# Altium project MCORD_Hub_v1.1.PrjPcb (part 1 of 4)
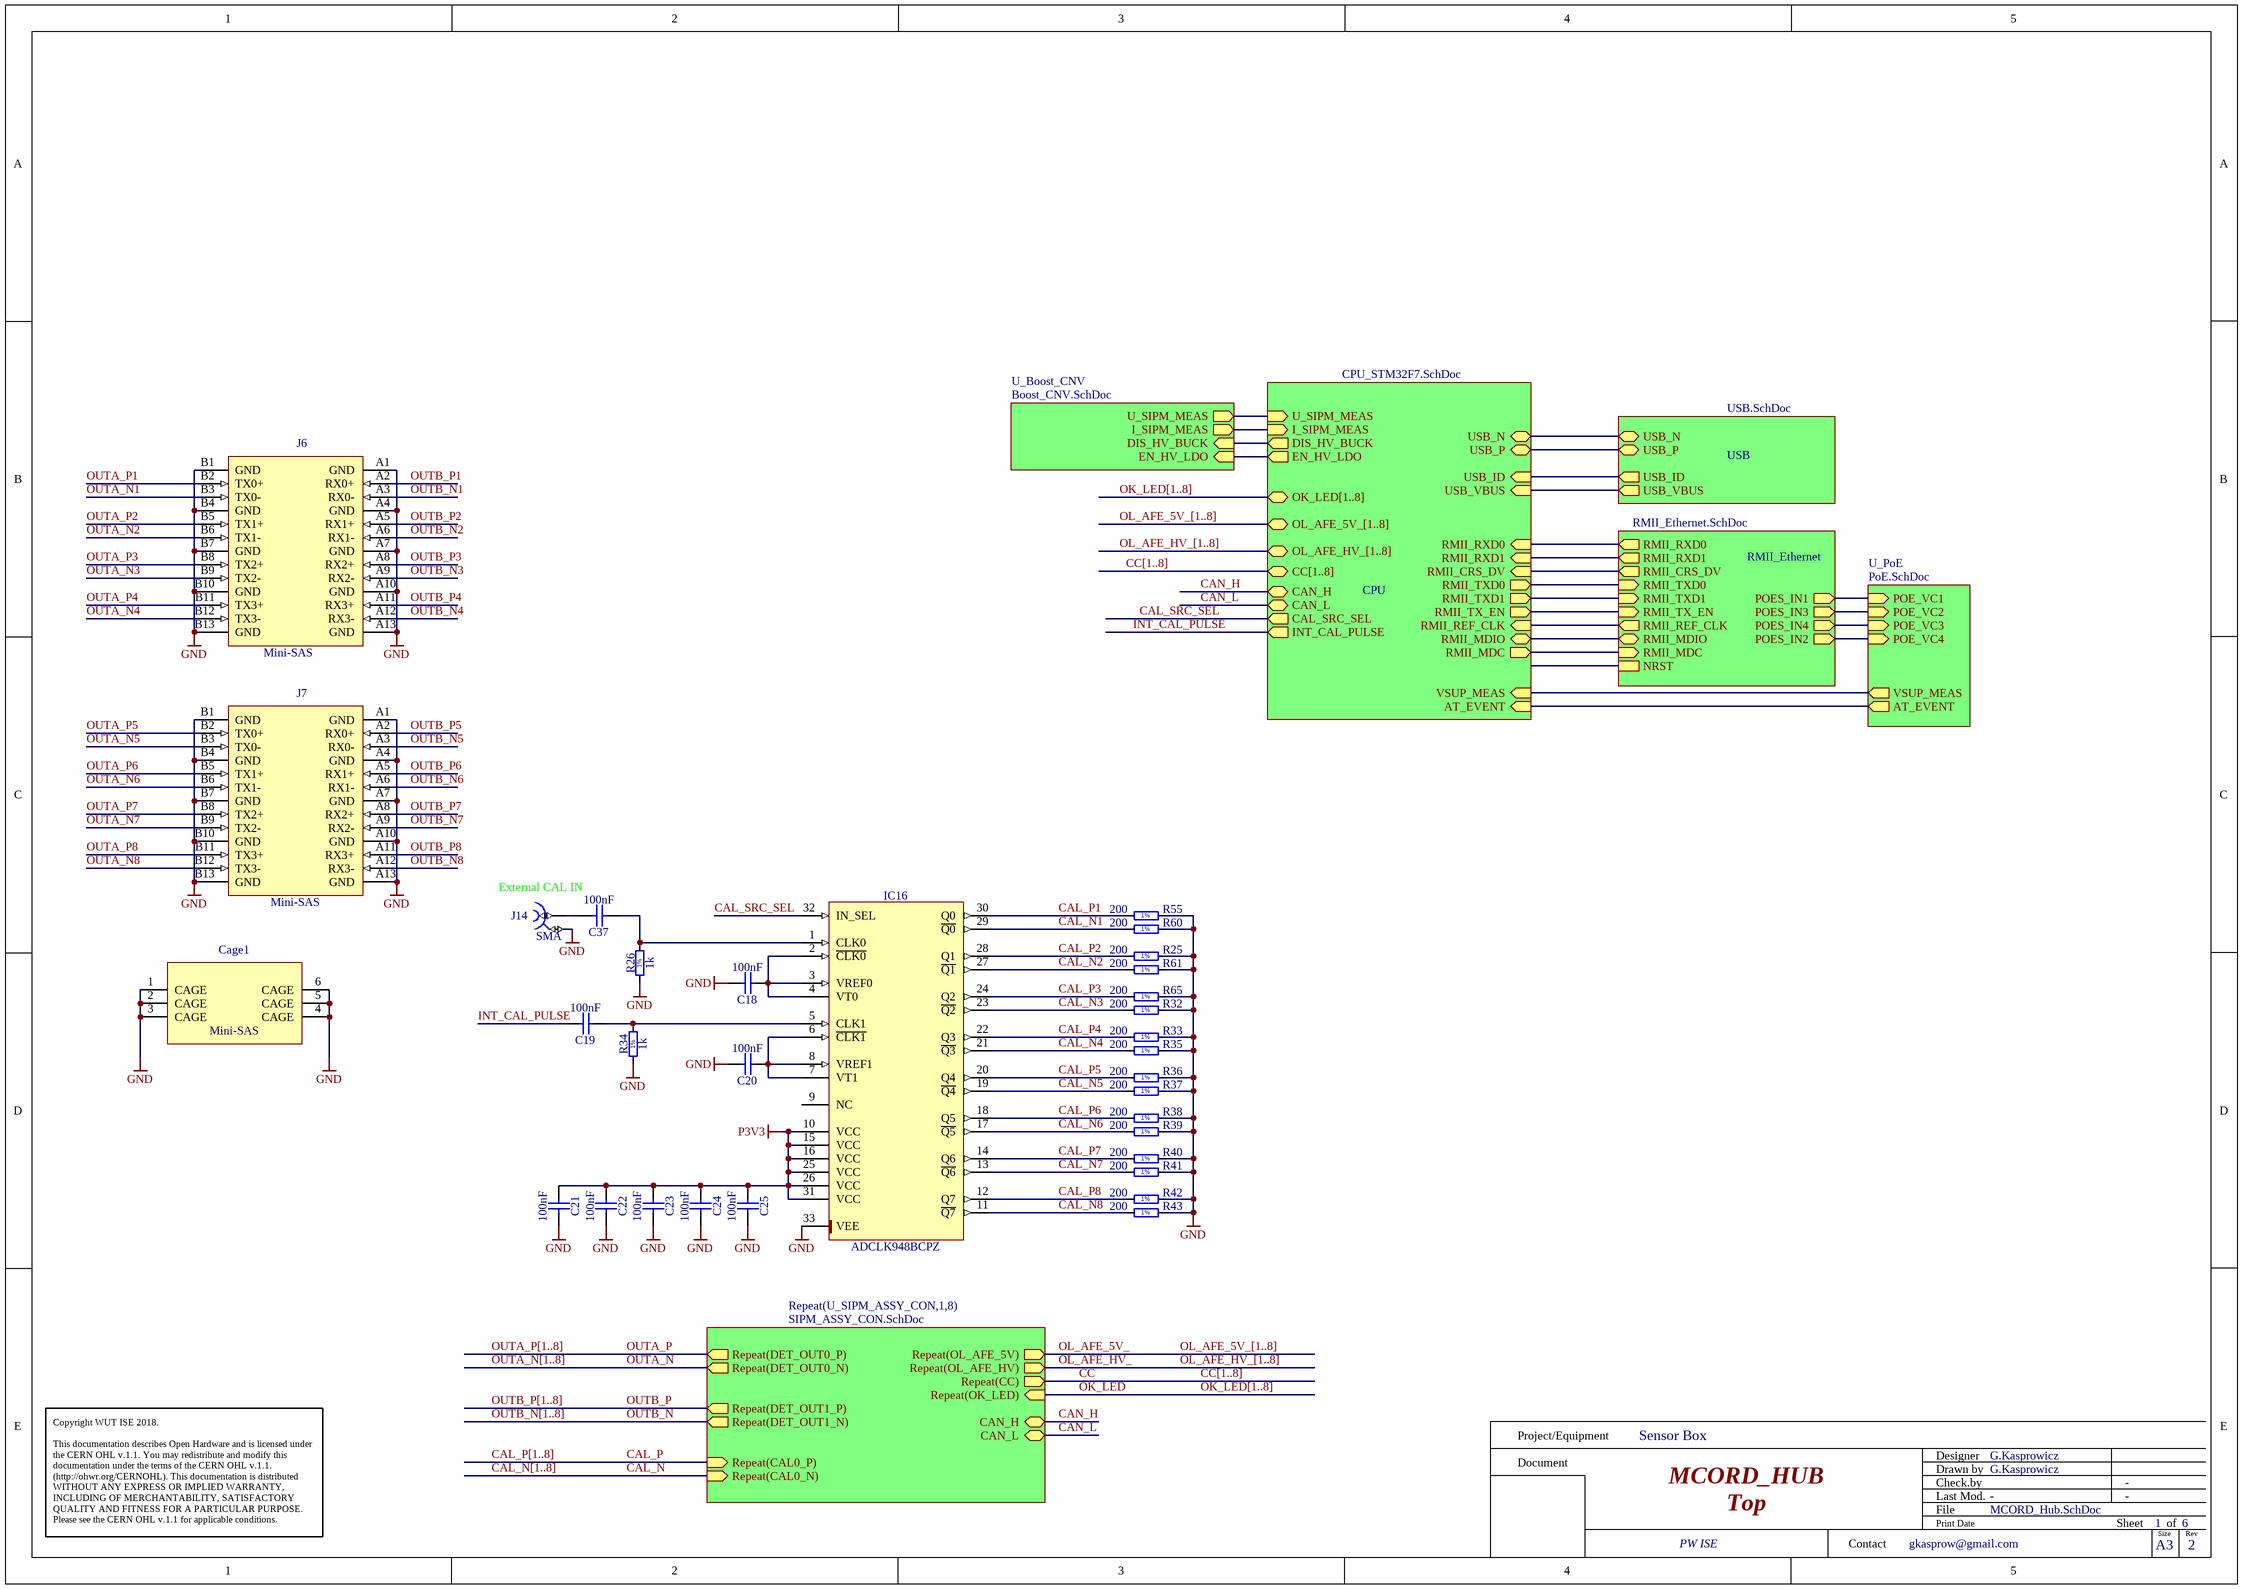
[diagram p0: MCORD_Hub.SchDoc]
7 sheets, 384 parts. Net scope: hierarchical (ports join the sheet entries above them; power ports are global).
Board file: MCORD_Hub.PcbDoc
Sheets:
  MCORD_Hub.SchDoc
    U_SIPM_ASSY_CON1 = SIPM_ASSY_CON.SchDoc
    U_SIPM_ASSY_CON2 = SIPM_ASSY_CON.SchDoc
    U_SIPM_ASSY_CON3 = SIPM_ASSY_CON.SchDoc
    U_SIPM_ASSY_CON4 = SIPM_ASSY_CON.SchDoc
    U_SIPM_ASSY_CON5 = SIPM_ASSY_CON.SchDoc
    U_SIPM_ASSY_CON6 = SIPM_ASSY_CON.SchDoc
    U_SIPM_ASSY_CON7 = SIPM_ASSY_CON.SchDoc
    U_SIPM_ASSY_CON8 = SIPM_ASSY_CON.SchDoc
    U_Boost_CNV = Boost_CNV.SchDoc
    RMII_Ethernet = RMII_Ethernet.SchDoc
    USB = USB.SchDoc
    CPU = CPU_STM32F7.SchDoc
    U_PoE = PoE.SchDoc

## Sheet MCORD_Hub.SchDoc: MCORD_HUB
size 420 x 297 mm; Author: G.Kasprowicz; CompanyName: WUT ISE; DrawnBy: G.Kasprowicz; Organization: WUT ISE; Address1: PW ISE; Address2: Nowowiejska 15/19 00-665 Warsaw; Address3: gkasprow@gmail.com; DocumentNumber: 1; Revision: 2; SheetNumber: 1; SheetTotal: 6; ModifiedBy: -; CheckedDate: -; Title2: Top; DivGrp: WUT ISE; Designer: G.Kasprowicz; ModifiedDate: -; ProjectName: Sensor Box

### Parts
C18  100nF  [CAPC1005X55N]
C19  100nF  [CAPC1005X55N]
C20  100nF  [CAPC1005X55N]
C21  100nF  [CAPC1005X55N]
C22  100nF  [CAPC1005X55N]
C23  100nF  [CAPC1005X55N]
C24  100nF  [CAPC1005X55N]
C25  100nF  [CAPC1005X55N]
C37  100nF  [CAPC1005X55N]
Cage1  Mini-SAS  [TYCO_1888321-2]
IC16  ADCLK948BCPZ  [QFN50P500X500X80-33N-S285]
J6  Mini-SAS  [TYCO_1761987-7]
J7  Mini-SAS  [TYCO_1761987-7]
J14  SMA  [RF249BT0050GHDW]
R25  200  [RESC1005X40N]
R26  1k  [RESC1005X40N]
R32  200  [RESC1005X40N]
R33  200  [RESC1005X40N]
R34  1k  [RESC1005X40N]
R35  200  [RESC1005X40N]
R36  200  [RESC1005X40N]
R37  200  [RESC1005X40N]
R38  200  [RESC1005X40N]
R39  200  [RESC1005X40N]
R40  200  [RESC1005X40N]
R41  200  [RESC1005X40N]
R42  200  [RESC1005X40N]
R43  200  [RESC1005X40N]
R55  200  [RESC1005X40N]
R60  200  [RESC1005X40N]
R61  200  [RESC1005X40N]
R65  200  [RESC1005X40N]

### Sub-sheets
CPU = CPU_STM32F7.SchDoc: USB_N (bidir), USB_P (bidir), USB_ID (in), USB_VBUS (in), RMII_TXD0 (out), RMII_TX_EN (out), RMII_RXD0 (in), RMII_REF_CLK (in), RMII_CRS_DV (in), RMII_MDC (out), RMII_MDIO (bidir), RMII_TXD1 (out), RMII_RXD1 (in), U_SIPM_MEAS (in), I_SIPM_MEAS (in), DIS_HV_BUCK (out), EN_HV_LDO (out), CC[1..8] (bidir), CAN_H (bidir), CAN_L (bidir), CAL_SRC_SEL (out), INT_CAL_PULSE (out), OL_AFE_HV_[1..8] (bidir), OL_AFE_5V_[1..8] (bidir), OK_LED[1..8] (bidir), AT_EVENT (in), VSUP_MEAS (in)
Repeat(U_SIPM_ASSY_CON,1,8) = SIPM_ASSY_CON.SchDoc: Repeat(CAL0_N) (in), Repeat(DET_OUT1_N) (out), Repeat(DET_OUT0_N) (out), Repeat(DET_OUT1_P) (out), Repeat(CAL0_P) (in), CAN_H (bidir), Repeat(DET_OUT0_P) (out), CAN_L (bidir), Repeat(CC) (out), Repeat(OL_AFE_HV) (out), Repeat(OL_AFE_5V) (out), Repeat(OK_LED) (in)
RMII_Ethernet = RMII_Ethernet.SchDoc: RMII_TXD0 (in), RMII_TX_EN (in), RMII_RXD0 (out), RMII_REF_CLK (out), RMII_CRS_DV (out), RMII_MDC (in), RMII_MDIO (bidir), NRST, RMII_TXD1 (in), RMII_RXD1 (out), POES_IN1 (out), POES_IN3 (out), POES_IN4 (out), POES_IN2 (out)
U_Boost_CNV = Boost_CNV.SchDoc: U_SIPM_MEAS (out), I_SIPM_MEAS (out), EN_HV_LDO (in), DIS_HV_BUCK (in)
U_PoE = PoE.SchDoc: POE_VC1 (in), POE_VC2 (in), POE_VC3 (in), POE_VC4 (in), AT_EVENT (out), VSUP_MEAS (out)
USB = USB.SchDoc: USB_N (bidir), USB_P (bidir), USB_ID (out), USB_VBUS (out)

### Nets
GND: C18.2 C20.2 C21.2 C22.2 C23.2 C24.2 C25.2 Cage1.1(CAGE) Cage1.2(CAGE) Cage1.3(CAGE) Cage1.4(CAGE) Cage1.5(CAGE) Cage1.6(CAGE) IC16.33(VEE) J6.A1(GND) J6.A4(GND) J6.A7(GND) J6.A10(GND) J6.A13(GND) J6.B1(GND) J6.B4(GND) J6.B7(GND) J6.B10(GND) J6.B13(GND) J7.A1(GND) J7.A4(GND) J7.A7(GND) J7.A10(GND) J7.A13(GND) J7.B1(GND) J7.B4(GND) J7.B7(GND) J7.B10(GND) J7.B13(GND) J14.2 R25.2 R26.1 R32.2 R33.2 R34.1 R35.2 R36.2 R37.2 R38.2 R39.2 R40.2 R41.2 R42.2 R43.2 R55.2 R60.2 R61.2 R65.2
P3V3: C21.1 C22.1 C23.1 C24.1 C25.1 IC16.10(VCC) IC16.15(VCC) IC16.16(VCC) IC16.25(VCC) IC16.26(VCC) IC16.31(VCC)
AT_EVENT: sheet CPU/AT_EVENT, sheet U_PoE/AT_EVENT
CAL_N: sheet Repeat(U_SIPM_ASSY_CON,1,8)/Repeat(CAL0_N)
CAL_N1: IC16.29(~{Q0}) R60.1  [project net CAL0_N]
CAL_N2: IC16.27(~{Q1}) R61.1  [project net CAL0_N]
CAL_N3: IC16.23(~{Q2}) R32.1  [project net CAL0_N]
CAL_N4: IC16.21(~{Q3}) R35.1  [project net CAL0_N]
CAL_N5: IC16.19(~{Q4}) R37.1  [project net CAL0_N]
CAL_N6: IC16.17(~{Q5}) R39.1  [project net CAL0_N]
CAL_N7: IC16.13(~{Q6}) R41.1  [project net CAL0_N]
CAL_N8: IC16.11(~{Q7}) R43.1  [project net CAL0_N]
CAL_P: sheet Repeat(U_SIPM_ASSY_CON,1,8)/Repeat(CAL0_P)
CAL_P1: IC16.30(Q0) R55.1  [project net CAL0_P]
CAL_P2: IC16.28(Q1) R25.1  [project net CAL0_P]
CAL_P3: IC16.24(Q2) R65.1  [project net CAL0_P]
CAL_P4: IC16.22(Q3) R33.1  [project net CAL0_P]
CAL_P5: IC16.20(Q4) R36.1  [project net CAL0_P]
CAL_P6: IC16.18(Q5) R38.1  [project net CAL0_P]
CAL_P7: IC16.14(Q6) R40.1  [project net CAL0_P]
CAL_P8: IC16.12(Q7) R42.1  [project net CAL0_P]
CAL_SRC_SEL: IC16.32(IN_SEL) ; sheet CPU/CAL_SRC_SEL
CAN_H: sheet Repeat(U_SIPM_ASSY_CON,1,8)/CAN_H, sheet CPU/CAN_H
CAN_L: sheet Repeat(U_SIPM_ASSY_CON,1,8)/CAN_L, sheet CPU/CAN_L
CC: sheet Repeat(U_SIPM_ASSY_CON,1,8)/Repeat(CC)
DIS_HV_BUCK: sheet U_Boost_CNV/DIS_HV_BUCK, sheet CPU/DIS_HV_BUCK
EN_HV_LDO: sheet U_Boost_CNV/EN_HV_LDO, sheet CPU/EN_HV_LDO
I_SIPM_MEAS: sheet U_Boost_CNV/I_SIPM_MEAS, sheet CPU/I_SIPM_MEAS
INT_CAL_PULSE: C19.2 ; sheet CPU/INT_CAL_PULSE
OK_LED: sheet Repeat(U_SIPM_ASSY_CON,1,8)/Repeat(OK_LED)
OL_AFE_5V_: sheet Repeat(U_SIPM_ASSY_CON,1,8)/Repeat(OL_AFE_5V)  [also labelled OL_AFE_5V_[1..8]]
OL_AFE_HV_: sheet Repeat(U_SIPM_ASSY_CON,1,8)/Repeat(OL_AFE_HV)  [also labelled OL_AFE_HV_[1..8]]
OUTA_N: sheet Repeat(U_SIPM_ASSY_CON,1,8)/Repeat(DET_OUT0_N)
OUTA_N1: J6.B3(TX0-)  [project net DET_OUT0_N]
OUTA_N2: J6.B6(TX1-)  [project net DET_OUT0_N]
OUTA_N3: J6.B9(TX2-)  [project net DET_OUT0_N]
OUTA_N4: J6.B12(TX3-)  [project net DET_OUT0_N]
OUTA_N5: J7.B3(TX0-)  [project net DET_OUT0_N]
OUTA_N6: J7.B6(TX1-)  [project net DET_OUT0_N]
OUTA_N7: J7.B9(TX2-)  [project net DET_OUT0_N]
OUTA_N8: J7.B12(TX3-)  [project net DET_OUT0_N]
OUTA_P: sheet Repeat(U_SIPM_ASSY_CON,1,8)/Repeat(DET_OUT0_P)
OUTA_P1: J6.B2(TX0+)  [project net DET_OUT0_P]
OUTA_P2: J6.B5(TX1+)  [project net DET_OUT0_P]
OUTA_P3: J6.B8(TX2+)  [project net DET_OUT0_P]
OUTA_P4: J6.B11(TX3+)  [project net DET_OUT0_P]
OUTA_P5: J7.B2(TX0+)  [project net DET_OUT0_P]
OUTA_P6: J7.B5(TX1+)  [project net DET_OUT0_P]
OUTA_P7: J7.B8(TX2+)  [project net DET_OUT0_P]
OUTA_P8: J7.B11(TX3+)  [project net DET_OUT0_P]
OUTB_N: sheet Repeat(U_SIPM_ASSY_CON,1,8)/Repeat(DET_OUT1_N)
OUTB_N1: J6.A3(RX0-)  [project net DET_OUT1_N]
OUTB_N2: J6.A6(RX1-)  [project net DET_OUT1_N]
OUTB_N3: J6.A9(RX2-)  [project net DET_OUT1_N]
OUTB_N4: J6.A12(RX3-)  [project net DET_OUT1_N]
OUTB_N5: J7.A3(RX0-)  [project net DET_OUT1_N]
OUTB_N6: J7.A6(RX1-)  [project net DET_OUT1_N]
OUTB_N7: J7.A9(RX2-)  [project net DET_OUT1_N]
OUTB_N8: J7.A12(RX3-)  [project net DET_OUT1_N]
OUTB_P: sheet Repeat(U_SIPM_ASSY_CON,1,8)/Repeat(DET_OUT1_P)
OUTB_P1: J6.A2(RX0+)  [project net DET_OUT1_P]
OUTB_P2: J6.A5(RX1+)  [project net DET_OUT1_P]
OUTB_P3: J6.A8(RX2+)  [project net DET_OUT1_P]
OUTB_P4: J6.A11(RX3+)  [project net DET_OUT1_P]
OUTB_P5: J7.A2(RX0+)  [project net DET_OUT1_P]
OUTB_P6: J7.A5(RX1+)  [project net DET_OUT1_P]
OUTB_P7: J7.A8(RX2+)  [project net DET_OUT1_P]
OUTB_P8: J7.A11(RX3+)  [project net DET_OUT1_P]
POES_IN1: sheet RMII_Ethernet/POES_IN1, sheet U_PoE/POE_VC1
POES_IN2: sheet RMII_Ethernet/POES_IN2, sheet U_PoE/POE_VC4
POES_IN3: sheet RMII_Ethernet/POES_IN3, sheet U_PoE/POE_VC2
POES_IN4: sheet RMII_Ethernet/POES_IN4, sheet U_PoE/POE_VC3
RMII_CRS_DV: sheet RMII_Ethernet/RMII_CRS_DV, sheet CPU/RMII_CRS_DV
RMII_MDC: sheet RMII_Ethernet/RMII_MDC, sheet CPU/RMII_MDC
RMII_MDIO: sheet RMII_Ethernet/RMII_MDIO, sheet CPU/RMII_MDIO
RMII_REF_CLK: sheet RMII_Ethernet/RMII_REF_CLK, sheet CPU/RMII_REF_CLK
RMII_RXD0: sheet RMII_Ethernet/RMII_RXD0, sheet CPU/RMII_RXD0
RMII_RXD1: sheet RMII_Ethernet/RMII_RXD1, sheet CPU/RMII_RXD1
RMII_TX_EN: sheet RMII_Ethernet/RMII_TX_EN, sheet CPU/RMII_TX_EN
RMII_TXD0: sheet RMII_Ethernet/RMII_TXD0, sheet CPU/RMII_TXD0
RMII_TXD1: sheet RMII_Ethernet/RMII_TXD1, sheet CPU/RMII_TXD1
U_SIPM_MEAS: sheet U_Boost_CNV/U_SIPM_MEAS, sheet CPU/U_SIPM_MEAS
USB_ID: sheet USB/USB_ID, sheet CPU/USB_ID
USB_N: sheet USB/USB_N, sheet CPU/USB_N
USB_P: sheet USB/USB_P, sheet CPU/USB_P
USB_VBUS: sheet USB/USB_VBUS, sheet CPU/USB_VBUS
VSUP_MEAS: sheet CPU/VSUP_MEAS, sheet U_PoE/VSUP_MEAS
NetC18_1: C18.1 IC16.2(~{CLK0}) IC16.3(VREF0) IC16.4(VT0)
NetC19_1: C19.1 IC16.5(CLK1) R34.2
NetC20_1: C20.1 IC16.6(~{CLK1}) IC16.7(VT1) IC16.8(VREF1)
NetC37_1: C37.1 IC16.1(CLK0) R26.2
NetC37_2: C37.2 J14.1

Not connected (* = marked no-connect by the designer): IC16 9(NC)

### Buses and harness runs
bus CAL_N[1..8]
bus CAL_P[1..8]
bus CC[1..8]
bus CC[1..8] = sheet CPU/CC[1..8]
bus OK_LED[1..8]
bus OK_LED[1..8] = sheet CPU/OK_LED[1..8]
bus OL_AFE_5V_[1..8] = sheet CPU/OL_AFE_5V_[1..8]
bus OL_AFE_HV_[1..8] = sheet CPU/OL_AFE_HV_[1..8]
bus OUTA_N[1..8]
bus OUTA_P[1..8]
bus OUTB_N[1..8]
bus OUTB_P[1..8]

### Notes on the sheet
- External CAL IN
- Project/Equipment
- Document
- Designer
- Drawn by
- Check.by
- Copyright WUT ISE 2018.
  This documentation describes Open Hardware and is licensed under the CERN OHL v.1.1. You may redistribute and modify this documentation under the terms of the CERN OHL v.1.1. (http://ohwr.org/CERNOHL). This documentation is distributed WITHOUT ANY EXPRESS OR IMPLIED WARRANTY, INCLUDING OF MERCHANTABILITY, SATISFACTORY QUALITY AND FITNESS FOR A PARTICULAR PURPOSE. Please see the CERN OHL v.1.1 for applicable conditions.
- Contact
- File
- Last Mod.
- Print Date
- Sheet
- Size
- A3
- of
- Rev
- (in symbol R0402_1K_1%_0.0625W_100PPM) 1%
- (in symbol R0402_200R_1%_0.0625W_100PPM) 1%

### Library data of the parts
C18-C25 C37 = CC0402_100NF_16V_10%_X7R: Non-polarised capacitor; Part Description: SMD Multilayer Chip Ceramic Capacitor; Manufacturer: GENERIC; Manufacturer1 Part Number: GRM155R71C104KA88D; Voltage: 16V; TC: X7R; Tolerance: ±10%; Part Number: CC0402_100NF_16V_10%_X7R; Component Kind: Standard; Component Type: Standard; Pin Count: 2; Value: 100nF; Status: Not Recommended; Manufacturer Part Number: CC0402_100NF_16V_10%_X7R; Case: 0402; Mounted: Yes; Socket: No; SMD: Yes; Manufacturer1 Example: MURATA; Manufacturer1 ComponentHeight: 0.55mm; HelpURL: \\cern.ch\dfs\Applications\Altium\Datasheets\CC0402_X7R_MURATA_GRM.pdf; Author: CERN DEM JLC; CreateDate: 05.12.2013; LatestRevisionDate: 03.12.2007; Sense: No
Cage1 = TYCO_1888321-2: Mini-SAS Cage (6Pins); Part Description: Through Hole Dual Port EVERCLEAR Mini-SAS Cage; Manufacturer: TYCO ELECTRONICS; PressFit: No; Part Number: TYCO_1888321-2; Component Kind: Standard; Component Type: Standard; Pin Count: 10; Family: Mini-SAS; Mounted: Yes; Socket: No; SMD: No; Sense: No; Status: None; Manufacturer Part Number: 1888321-2; ComponentHeight: 8.63mm; HelpURL: \\cern.ch\dfs\Applications\Altium\Datasheets\TYCO_1888321-2.pdf; Author: CERN DEM BC; CreateDate: 04.04.2019; LatestRevisionDate: 04.04.2019
IC16 = ADCLK948BCPZ: Two Selectable Inputs, 8 LVPECL Outputs, SiGe Clock Fanout Buffer; Manufacturer: ANALOG DEVICES; PressFit: No; Bonding: No; Part Number: ADCLK948BCPZ; Component Kind: Standard; Component Type: Standard; Device: ADCLK948BCPZ; PackageDescription: QFN, 0.50mm Pitch, Square; 8 Pin X 8 Pin, 5mm X 5mm X 1.00mm H body (w/thermal tab 2.85 X 2.85mm),  IPC Medium Density; Part Description: Two Selectable Inputs, 8 LVPECL Outputs, SiGe Clock Fanout Buffer; Manufacturer Part Number: ADCLK948BCPZ; Pin Count: 33; Case: QFN32; Mounted: Yes; Socket: No; SMD: Yes; Sense: No; ComponentHeight: 0.8mm; Author: CERN DEM MR; HelpURL: \\cern.ch\dfs\Applications\Altium\Datasheets\ADCLK948BCPZ.pdf; CreateDate: 30.11.2016; LatestRevisionDate: 30.11.2016
J6 J7 = TYCO_1761987-7: 26 Position Mini-Sas Connector (Quad Small Form-Factor SFF-8088); Part Description: Surface Mount EVERCLEAR Mini-SAS Right Angle Receptacle (Quad Small Form-Factor SFF-8088); Manufacturer: TYCO ELECTRONICS; PressFit: No; Part Number: TYCO_1761987-7; Component Kind: Standard; Component Type: Standard; Pin Count: 26; Family: Mini-SAS; Mounted: Yes; Socket: No; SMD: Yes; Sense: No; Status: None; Manufacturer Part Number: 1761987-7; ComponentHeight: 5.55mm; HelpURL: \\cern.ch\dfs\Applications\Altium\Datasheets\TYCO_1761987-7.pdf; Author: CERN DEM MR; CreateDate: 24.04.2019; LatestRevisionDate: 24.04.2019
J14 = CON_SMA_RF249BT0050GHDW: 50 Ohm Through Hole SMA Right Angle PCB Jack; Part Number: AdamTech_RF249BT0050GHDW; Manufacturer: AdamTech / Molex; Manufacturer Part Number: RF249BT0050GHDW / 0732512201; PressFit: No; Component Kind: Standard; Component Type: Standard; Pin Count: 5; Family: SMA; Mounted: Yes; Socket: No; SMD: No; Sense: No; Status: None; Part Description: 50 Ohm Through Hole SMA Right Angle PCB Jack; ComponentHeight: 10.44mm; HelpURL: \\cern.ch\dfs\Applications\Altium\Datasheets\AMPHENOL_132203.pdf; Author: GK; CreateDate: 06.10.2016; LatestRevisionDate: 06.10.2016
R25 R32 R33 R35-R43 R55 R60 R61 R65 = R0402_200R_1%_0.0625W_100PPM: Resistor - 1%; Part Description: General Purpose Thick Film Chip Resistor; Manufacturer: GENERIC; Manufacturer1 Part Number: 232270672001L; TC: ±100ppm/°C; PressFit: No; Part Number: R0402_200R_1%_0.0625W_100PPM; Component Kind: Standard; Component Type: Standard; Pin Count: 2; Value: 200; Status: Not Recommended; Power: 0.0625W; Tolerance: ±1%; Manufacturer Part Number: R0402_200R_1%_0.0625W_100PPM; Case: 0402; Mounted: Yes; Sense: No; Socket: No; SMD: Yes; Manufacturer1 Example: YAGEO PHYCOMP; Manufacturer1 ComponentHeight: 0.4mm; HelpURL: \\cern.ch\dfs\Applications\Altium\Datasheets\R0402_Phycomp_RC0402.pdf; Author: CERN DEM JLC; CreateDate: 03.12.2007; LatestRevisionDate: 17.10.2012
R26 R34 = R0402_1K_1%_0.0625W_100PPM: Resistor - 1%; Part Description: General Purpose Thick Film Chip Resistor; Manufacturer: GENERIC; Manufacturer1 Part Number: 232270671002L; TC: ±100ppm/°C; PressFit: No; Part Number: R0402_1K_1%_0.0625W_100PPM; Component Kind: Standard; Component Type: Standard; Pin Count: 2; Value: 1k; Status: Not Recommended; Power: 0.0625W; Tolerance: ±1%; Manufacturer Part Number: R0402_1K_1%_0.0625W_100PPM; Case: 0402; Mounted: Yes; Sense: No; Socket: No; SMD: Yes; Manufacturer1 Example: YAGEO PHYCOMP; Manufacturer1 ComponentHeight: 0.4mm; HelpURL: \\cern.ch\dfs\Applications\Altium\Datasheets\R0402_Phycomp_RC0402.pdf; Author: CERN DEM JLC; CreateDate: 03.12.2007; LatestRevisionDate: 17.10.2012

## Sheet SIPM_ASSY_CON.SchDoc: MCORD_HUB
size 420 x 297 mm; Author: G.Kasprowicz; CompanyName: WUT ISE; DrawnBy: G.Kasprowicz; Organization: WUT ISE; Address1: PW ISE; Address2: Nowowiejska 15/19 00-665 Warsaw; Address3: gkasprow@gmail.com; DocumentNumber: 2; Revision: 2; SheetNumber: 2; SheetTotal: 6; ModifiedBy: -; CheckedDate: -; Title2: SIPM ASSY connector; DivGrp: WUT ISE; Designer: G.Kasprowicz; ModifiedDate: -; ProjectName: Sensor Box
Used 8 times, as channels U_SIPM_ASSY_CON1, U_SIPM_ASSY_CON2, U_SIPM_ASSY_CON3, U_SIPM_ASSY_CON4, U_SIPM_ASSY_CON5, U_SIPM_ASSY_CON6, U_SIPM_ASSY_CON7, U_SIPM_ASSY_CON8. Parts and nets are listed once, with the designators drawn on the sheet.
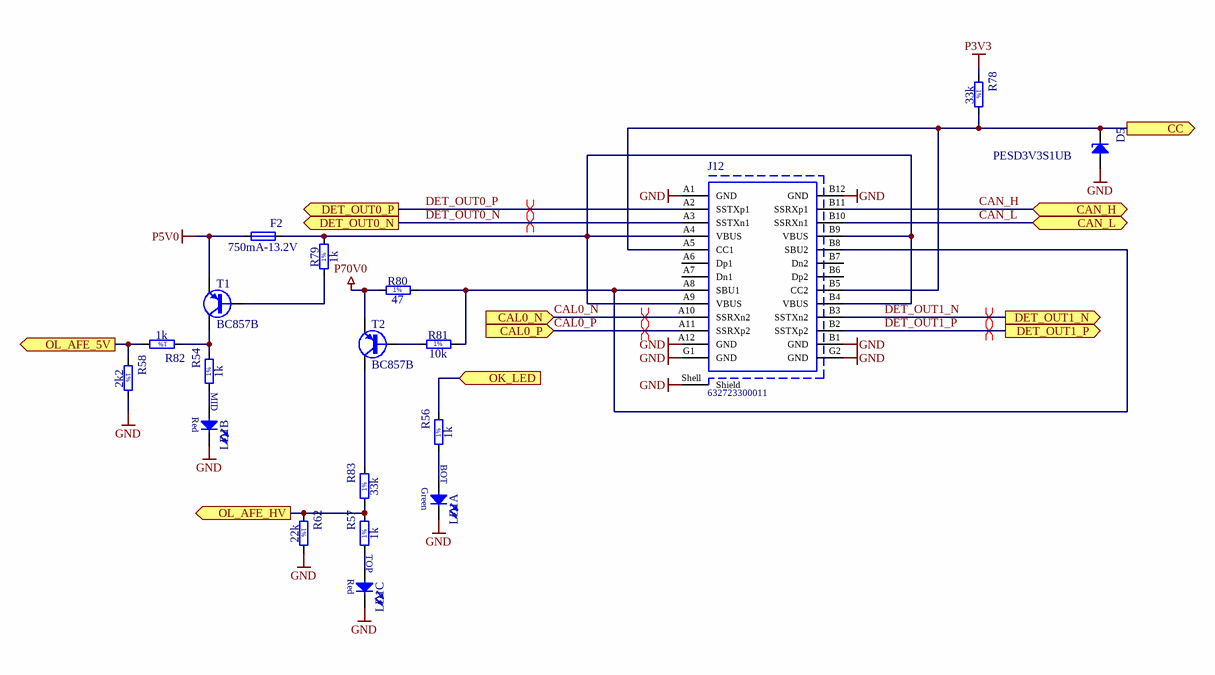
[diagram p1: SIPM_ASSY_CON.SchDoc]

### Parts
D5  PESD3V3S1UB  [SODFL1608X65N]
F2  750mA-13.2V  [FUSRC4632X90N]
J12  632723300011  [632723300011]
LD1  Red/Red/Green  [LED_DIALIGHT_570-0100-112F]  (value not drawn)  (parts A,B,C of 3)
R54  1k  [RESC1005X40N]
R56  1k  [RESC1005X40N]
R57  1k  [RESC1005X40N]
R58  2k2  [RESC1005X40N]
R62  22k  [RESC1005X40N]
R78  33k  [RESC2012X60N]
R79  1k  [RESC1005X40N]
R80  47  [RESC1608X55N]
R81  10k  [RESC2012X60N]
R82  1k  [RESC1005X40N]
R83  33k  [RESC2012X60N]
T1  BC857B  [SOT95P230X110-3N]
T2  BC857B  [SOT95P230X110-3N]

### Ports
CAL0_N (in), CAL0_P (in), CAN_H (bidir), CAN_L (bidir), CC (out), DET_OUT0_N (out), DET_OUT0_P (out), DET_OUT1_N (out), DET_OUT1_P (out), OK_LED (in), OL_AFE_5V (out), OL_AFE_HV (out)

### Nets
GND: D5.2(A) J12.A1(GND) J12.A12(GND) J12.B1(GND) J12.B12(GND) J12.G1(GND) J12.G2(GND) J12.Shell(Shield) LD1.2(C) LD1.4(C) LD1.6(C) R58.2 R62.2
P3V3: R78.1
P5V0: F2.1 T1.2(E)
P70V0: R80.1 T2.2(E)
CAL0_N: J12.A10(SSRXn2) ; port CAL0_N
CAL0_P: J12.A11(SSRXp2) ; port CAL0_P
CAN_H: J12.B11(SSRXp1) ; port CAN_H
CAN_L: J12.B10(SSRXn1) ; port CAN_L
CC: D5.1(C) J12.A5(CC1) J12.B5(CC2) R78.2 ; port CC
DET_OUT0_N: J12.A3(SSTXn1) ; port DET_OUT0_N
DET_OUT0_P: J12.A2(SSTXp1) ; port DET_OUT0_P
DET_OUT1_N: J12.B3(SSTXn2) ; port DET_OUT1_N
DET_OUT1_P: J12.B2(SSTXp2) ; port DET_OUT1_P
OK_LED: R56.2 ; port OK_LED
OL_AFE_5V: R58.1 R82.2 ; port OL_AFE_5V
OL_AFE_HV: R57.2 R62.1 R83.1 ; port OL_AFE_HV
NetF2_2: F2.2 J12.A4(VBUS) J12.A9(VBUS) J12.B4(VBUS) J12.B9(VBUS) R79.2
NetJ12_A8: J12.A8(SBU1) J12.B8(SBU2) R80.2 R81.2
NetLD1_1: LD1.1(A) R56.1
NetLD1_3: LD1.3(A) R54.1
NetLD1_5: LD1.5(A) R57.1
NetR54_2: R54.2 R82.1 T1.3(C)
NetR79_1: R79.1 T1.1(B)
NetR81_1: R81.1 T2.1(B)
NetR83_2: R83.2 T2.3(C)

Not connected (* = marked no-connect by the designer): J12 A6(Dp1) A7(Dn1) B6(Dp2) B7(Dn2)

### Channels
U_SIPM_ASSY_CON1: designators end in A; ports CAL0_N=CAL0_N CAL0_P=CAL0_P CAN_H=CAN_H CAN_L=CAN_L CC=CC1 DET_OUT0_N=DET_OUT0_N DET_OUT0_P=DET_OUT0_P DET_OUT1_N=DET_OUT1_N DET_OUT1_P=DET_OUT1_P OK_LED=OK_LED1 OL_AFE_5V=OL_AFE_5V_1 OL_AFE_HV=OL_AFE_HV_1
U_SIPM_ASSY_CON2: designators end in B; ports CAL0_N=CAL0_N CAL0_P=CAL0_P CAN_H=CAN_H CAN_L=CAN_L CC=CC2 DET_OUT0_N=DET_OUT0_N DET_OUT0_P=DET_OUT0_P DET_OUT1_N=DET_OUT1_N DET_OUT1_P=DET_OUT1_P OK_LED=OK_LED2 OL_AFE_5V=OL_AFE_5V_2 OL_AFE_HV=OL_AFE_HV_2
U_SIPM_ASSY_CON3: designators end in C; ports CAL0_N=CAL0_N CAL0_P=CAL0_P CAN_H=CAN_H CAN_L=CAN_L CC=CC3 DET_OUT0_N=DET_OUT0_N DET_OUT0_P=DET_OUT0_P DET_OUT1_N=DET_OUT1_N DET_OUT1_P=DET_OUT1_P OK_LED=OK_LED3 OL_AFE_5V=OL_AFE_5V_3 OL_AFE_HV=OL_AFE_HV_3
U_SIPM_ASSY_CON4: designators end in D; ports CAL0_N=CAL0_N CAL0_P=CAL0_P CAN_H=CAN_H CAN_L=CAN_L CC=CC4 DET_OUT0_N=DET_OUT0_N DET_OUT0_P=DET_OUT0_P DET_OUT1_N=DET_OUT1_N DET_OUT1_P=DET_OUT1_P OK_LED=OK_LED4 OL_AFE_5V=OL_AFE_5V_4 OL_AFE_HV=OL_AFE_HV_4
U_SIPM_ASSY_CON5: designators end in E; ports CAL0_N=CAL0_N CAL0_P=CAL0_P CAN_H=CAN_H CAN_L=CAN_L CC=CC5 DET_OUT0_N=DET_OUT0_N DET_OUT0_P=DET_OUT0_P DET_OUT1_N=DET_OUT1_N DET_OUT1_P=DET_OUT1_P OK_LED=OK_LED5 OL_AFE_5V=OL_AFE_5V_5 OL_AFE_HV=OL_AFE_HV_5
U_SIPM_ASSY_CON6: designators end in F; ports CAL0_N=CAL0_N CAL0_P=CAL0_P CAN_H=CAN_H CAN_L=CAN_L CC=CC6 DET_OUT0_N=DET_OUT0_N DET_OUT0_P=DET_OUT0_P DET_OUT1_N=DET_OUT1_N DET_OUT1_P=DET_OUT1_P OK_LED=OK_LED6 OL_AFE_5V=OL_AFE_5V_6 OL_AFE_HV=OL_AFE_HV_6
U_SIPM_ASSY_CON7: designators end in G; ports CAL0_N=CAL0_N CAL0_P=CAL0_P CAN_H=CAN_H CAN_L=CAN_L CC=CC7 DET_OUT0_N=DET_OUT0_N DET_OUT0_P=DET_OUT0_P DET_OUT1_N=DET_OUT1_N DET_OUT1_P=DET_OUT1_P OK_LED=OK_LED7 OL_AFE_5V=OL_AFE_5V_7 OL_AFE_HV=OL_AFE_HV_7
U_SIPM_ASSY_CON8: designators end in H; ports CAL0_N=CAL0_N CAL0_P=CAL0_P CAN_H=CAN_H CAN_L=CAN_L CC=CC8 DET_OUT0_N=DET_OUT0_N DET_OUT0_P=DET_OUT0_P DET_OUT1_N=DET_OUT1_N DET_OUT1_P=DET_OUT1_P OK_LED=OK_LED8 OL_AFE_5V=OL_AFE_5V_8 OL_AFE_HV=OL_AFE_HV_8

### Layout directives
differential pair: CAL0_N, CAL0_P, DET_OUT0_N, DET_OUT0_P, DET_OUT1_N, DET_OUT1_P

### Notes on the sheet
- Project/Equipment
- Document
- Designer
- Drawn by
- Check.by
- Copyright WUT ISE 2018.
  This documentation describes Open Hardware and is licensed under the CERN OHL v.1.1. You may redistribute and modify this documentation under the terms of the CERN OHL v.1.1. (http://ohwr.org/CERNOHL). This documentation is distributed WITHOUT ANY EXPRESS OR IMPLIED WARRANTY, INCLUDING OF MERCHANTABILITY, SATISFACTORY QUALITY AND FITNESS FOR A PARTICULAR PURPOSE. Please see the CERN OHL v.1.1 for applicable conditions.
- Contact
- File
- Last Mod.
- Print Date
- Sheet
- Size
- A3
- of
- Rev
- (in symbol LED_DIALIGHT_570-0100-112F, part A) BOT; Green
- (in symbol LED_DIALIGHT_570-0100-112F, part B) MID; Red
- (in symbol LED_DIALIGHT_570-0100-112F, part C) TOP; Red
- (in symbol R0402_1K_1%_0.0625W_100PPM) 1%
- (in symbol R0402_2K2_1%_0.0625W_100PPM) 1%
- (in symbol R0402_22K_1%_0.0625W_100PPM) 1%
- (in symbol R0603_47R_1%_0.1W_100PPM) 1%
- (in symbol R0805_10K_1%_0.125W_100PPM) 1%
- (in symbol R0805_33K_1%_0.125W_100PPM) 1%

### Library data of the parts
D5 = PESD3V3S1UB: ESD protection diode; Part Description: ESD protection diode (23kV); Manufacturer: NXP SEMICONDUCTORS; Voltage: 3V3; Power: 330W; PressFit: No; Bonding: No; Part Number: PESD3V3S1UB; Component Kind: Standard; Component Type: Standard; Device: PESD3V3S1UB; PackageDescription: Ultra Small Outline Diode Flat Lead (SOD-523), Body; 1.2mm L X 0.8mm W X 0.65mm H, IPC Medium Density; Manufacturer Part Number: PESD3V3S1UB; Pin Count: 2; Case: SOD523; Mounted: Yes; Socket: No; SMD: Yes; Sense: No; ComponentHeight: 0.65mm; HelpURL: \\cern.ch\dfs\Applications\Altium\Datasheets\PESD3V3S1UB.pdf; Author: CERN DEM JLC; CreateDate: 29.11.2012; LatestRevisionDate: 29.11.2012
F2 = FUSR1812_LITTELFUSE_MINISMDC075F-2: Fuse; Part Description: PolySwitch® PTC Overcurrent Protection Device; PressFit: No; Part Number: FUSR1812_LITTELFUSE_MINISMDC075F-2; Component Kind: Standard; Component Type: Standard; Pin Count: 2; PackageDescription: Chip Resettable Fuse, 2-Leads, Body 4.6x3.2mm, IPC Medium Density; Family: Fuses Resettable; Mounted: Yes; Socket: No; SMD: Yes; Sense: No; Value: 750mA-13.2V; Manufacturer: LITTELFUSE; Manufacturer Part Number: miniSMDC075F-2; ComponentHeight: 0.38mm; HelpURL: \\cern.ch\dfs\Applications\Altium\Datasheets\FUSR_LITTELFUSE_MINISMDC075F-2.pdf; Author: CERN DEM JLC; CreateDate: 19/06/2017; LatestRevisionDate: 17/08/2017
J12 = 632723300011: USB 3.1 Type C Receptacle WR-COM, Horizontal, SMT / THT; Rated Current: 5 A; Contact Resistance: 30 mOhm; Working Voltage: 20 VDC; ComponentLink1Description: Manufacturer; ComponentLink1URL: http://www.we-online.de; ComponentLink2Description: Datasheet; ComponentLink2URL: https://katalog.we-online.de/em/datasheet/632723x00011%282%29.pdf; Part Number: 632723300011; Published Date: September 2018; Publisher: Wurth Elektronik; Orientation: Horizontal; Connector Type: USB 3.1 Type C; Operating Temperature: -40 to 105 degC; Mounting Technology: SMT / THT; Gender: Receptacle; Packaging: Tape and Reel
LD1 = LED_DIALIGHT_570-0100-112F: LED x3  Top Red, Middle Red, Bottom Green; Part Description: Triple 2mm CBI® LEDs, Red Top, Red Middle, Green Bottom; PressFit: No; Bonding: No; Part Number: LED_DIALIGHT_570-0100-112F; Component Kind: Standard; Component Type: Standard; Color: Red/Red/Green; PackageDescription: 3x 2mm LED (Top: Red , Middle: Red, Bot: Green) PCB Edge Mounting DIALIGHT 570 Serie; Manufacturer: DIALIGHT; Manufacturer Part Number: 570-0100-112F; Pin Count: 6; Mounted: Yes; Socket: No; SMD: No; Sense: No; ComponentHeight: 10.41mm; HelpURL: \\cern.ch\dfs\Applications\Altium\Datasheets\LED_DIALIGHT_570-0100-112F.pdf; Author: CERN DEM JLC; CreateDate: 21.01.2013; LatestRevisionDate: 21.01.2013
R54 R56 R57 R79 R82 = R0402_1K_1%_0.0625W_100PPM: as R26 on sheet MCORD_Hub; Part Number: R0402_1K_1%_0.0625W_100PPM; Component Kind: Standard; Component Type: Standard; Pin Count: 2; Value: 1k; Status: Not Recommended; Power: 0.0625W; Tolerance: ±1%; Manufacturer Part Number: R0402_1K_1%_0.0625W_100PPM; Case: 0402; Mounted: Yes; Sense: No; Socket: No; SMD: Yes; Manufacturer1 Example: YAGEO PHYCOMP; Manufacturer1 ComponentHeight: 0.4mm; HelpURL: \\cern.ch\dfs\Applications\Altium\Datasheets\R0402_Phycomp_RC0402.pdf; Author: CERN DEM JLC; CreateDate: 03.12.2007; LatestRevisionDate: 17.10.2012
R58 = R0402_2K2_1%_0.0625W_100PPM: Resistor - 1%; Part Description: General Purpose Thick Film Chip Resistor; Manufacturer: GENERIC; Manufacturer1 Part Number: 232270672202L; TC: ±100ppm/°C; PressFit: No; Part Number: R0402_2K2_1%_0.0625W_100PPM; Component Kind: Standard; Component Type: Standard; Pin Count: 2; Value: 2k2; Status: Not Recommended; Power: 0.0625W; Tolerance: ±1%; Manufacturer Part Number: R0402_2K2_1%_0.0625W_100PPM; Case: 0402; Mounted: Yes; Sense: No; Socket: No; SMD: Yes; Manufacturer1 Example: YAGEO PHYCOMP; Manufacturer1 ComponentHeight: 0.4mm; HelpURL: \\cern.ch\dfs\Applications\Altium\Datasheets\R0402_Phycomp_RC0402.pdf; Author: CERN DEM JLC; CreateDate: 03.12.2007; LatestRevisionDate: 17.10.2012
R62 = R0402_22K_1%_0.0625W_100PPM: Resistor - 1%; Part Description: General Purpose Thick Film Chip Resistor; Manufacturer: GENERIC; Manufacturer1 Part Number: 232270672203L; TC: ±100ppm/°C; PressFit: No; Part Number: R0402_22K_1%_0.0625W_100PPM; Component Kind: Standard; Component Type: Standard; Pin Count: 2; Value: 22k; Status: Not Recommended; Power: 0.0625W; Tolerance: ±1%; Manufacturer Part Number: R0402_22K_1%_0.0625W_100PPM; Case: 0402; Mounted: Yes; Sense: No; Socket: No; SMD: Yes; Manufacturer1 Example: YAGEO PHYCOMP; Manufacturer1 ComponentHeight: 0.4mm; HelpURL: \\cern.ch\dfs\Applications\Altium\Datasheets\R0402_Phycomp_RC0402.pdf; Author: CERN DEM JLC; CreateDate: 03.12.2007; LatestRevisionDate: 17.10.2012
R78 R83 = R0805_33K_1%_0.125W_100PPM: Resistor - 1%; Part Description: General Purpose Thick Film Chip Resistor; Manufacturer: GENERIC; Manufacturer1 Part Number: NRC10F3302TRF; Power: 0.125W; TC: ±100ppm/°C; PressFit: No; Part Number: R0805_33K_1%_0.125W_100PPM; Component Kind: Standard; Component Type: Standard; Pin Count: 2; Value: 33k; Status: Preferred; Tolerance: ±1%; Manufacturer Part Number: R0805_33K_1%_0.125W_100PPM; Case: 0805; Mounted: Yes; Sense: No; Socket: No; SMD: Yes; Manufacturer1 Example: NIC COMPONENT; Manufacturer1 ComponentHeight: 0.6mm; HelpURL: \\cern.ch\dfs\Applications\Altium\Datasheets\R0805_NIC_NRC.pdf; Author: CERN DEM JLC; CreateDate: 03.12.2007; LatestRevisionDate: 13.03.2008
R80 = R0603_47R_1%_0.1W_100PPM: Resistor - 1%; Part Description: General Purpose Thick Film Chip Resistor; Manufacturer: GENERIC; Manufacturer1 Part Number: NRC06F47R0TRF; Power: 0.1W; TC: ±100ppm/°C; PressFit: No; Part Number: R0603_47R_1%_0.1W_100PPM; Component Kind: Standard; Component Type: Standard; Pin Count: 2; Value: 47; Status: Preferred; Tolerance: ±1%; Manufacturer Part Number: R0603_47R_1%_0.1W_100PPM; Case: 0603; Mounted: Yes; Sense: No; Socket: No; SMD: Yes; Manufacturer1 Example: NIC COMPONENT; Manufacturer1 ComponentHeight: 0.55mm; HelpURL: \\cern.ch\dfs\Applications\Altium\Datasheets\R0603_NIC_NRC.pdf; Author: CERN DEM JLC; CreateDate: 03/12/2007; LatestRevisionDate: 13/03/2008
R81 = R0805_10K_1%_0.125W_100PPM: Resistor - 1%; Part Description: General Purpose Thick Film Chip Resistor; Manufacturer: GENERIC; Manufacturer1 Part Number: NRC10F1002TRF; Power: 0.125W; TC: ±100ppm/°C; PressFit: No; Part Number: R0805_10K_1%_0.125W_100PPM; Component Kind: Standard; Component Type: Standard; Pin Count: 2; Value: 10k; Status: Preferred; Tolerance: ±1%; Manufacturer Part Number: R0805_10K_1%_0.125W_100PPM; Case: 0805; Mounted: Yes; Sense: No; Socket: No; SMD: Yes; Manufacturer1 Example: NIC COMPONENT; Manufacturer1 ComponentHeight: 0.6mm; HelpURL: \\cern.ch\dfs\Applications\Altium\Datasheets\R0805_NIC_NRC.pdf; Author: CERN DEM JLC; CreateDate: 03.12.2007; LatestRevisionDate: 13.03.2008
T1 T2 = BC857B: PNP Transistor; Part Description: 45V 100mA PNP general-purpose transistors; Manufacturer: NXP SEMICONDUCTORS; PressFit: No; Bonding: No; Part Number: BC857B; Component Kind: Standard; Component Type: Standard; Device: BC857B; PackageDescription: SOT23, 3 pin, Pitch 0.95mm - 1.3mm W X 2.9mm L X 1.1mm H, IPC Medium Density; Manufacturer Part Number: BC857B; Pin Count: 3; Case: SOT23-3; Mounted: Yes; Socket: No; SMD: Yes; Sense: No; ComponentHeight: 1.1mm; HelpURL: \\cern.ch\dfs\Applications\Altium\Datasheets\BC857B.pdf; Author: CERN DEM JLC; CreateDate: 14.06.2011; LatestRevisionDate: 14.06.2011